# Altium project controller_8266.PrjPcb
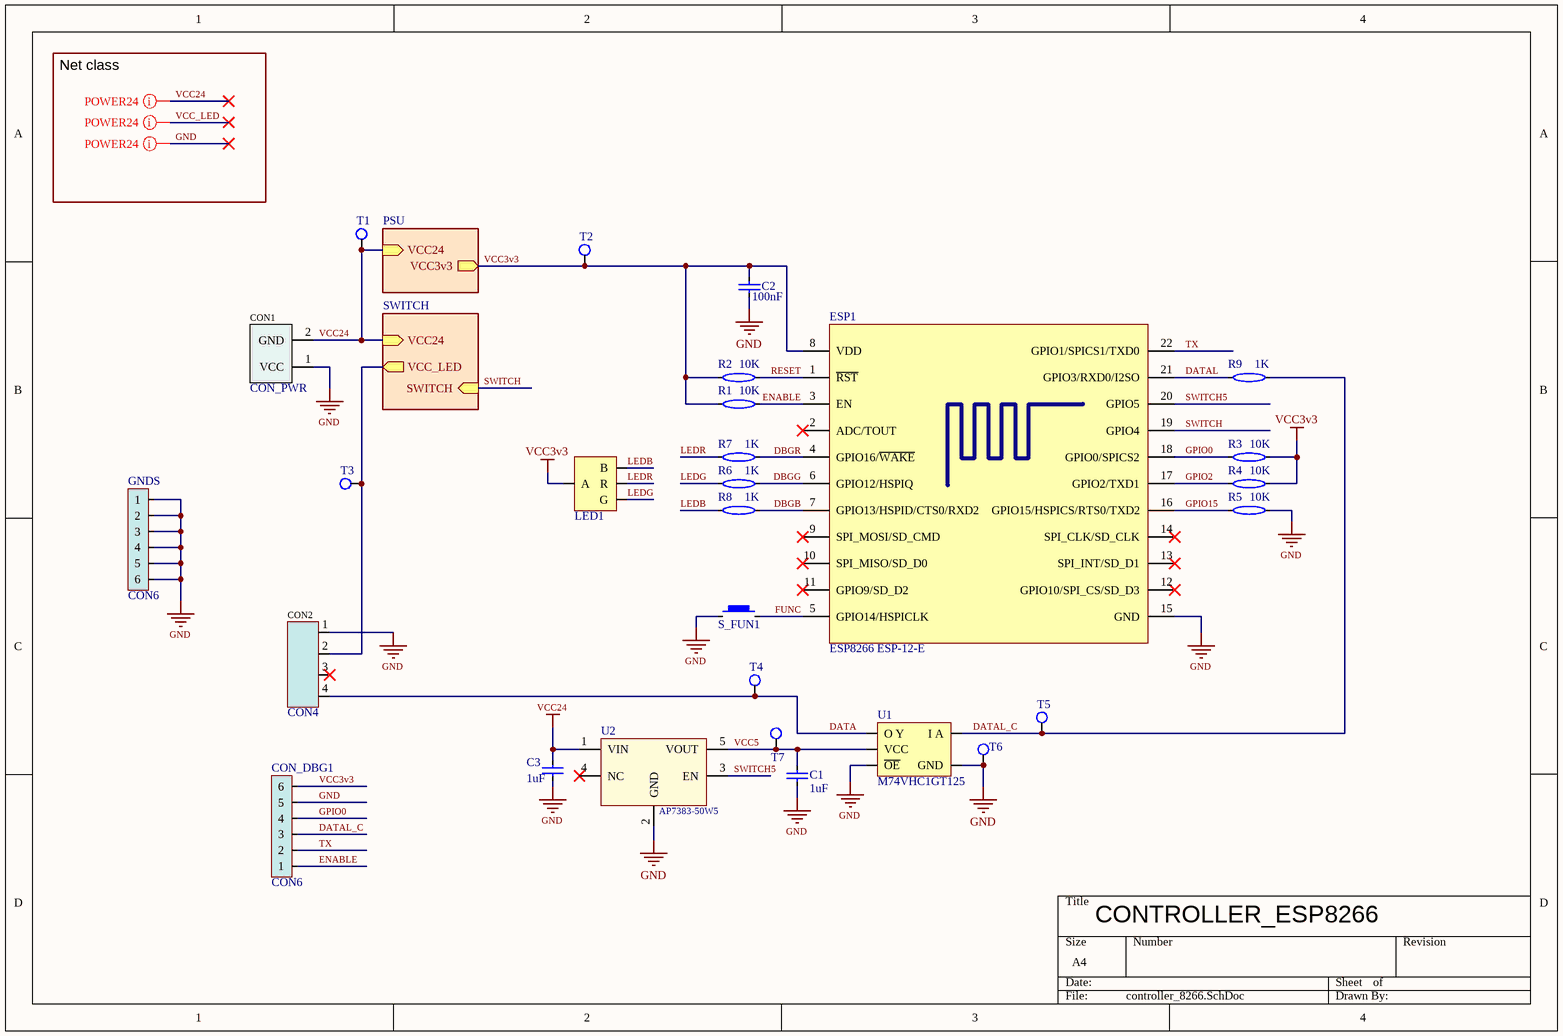
[diagram p0: controller_8266.SchDoc]
3 sheets, 44 parts. Net scope: hierarchical (ports join the sheet entries above them; power ports are global).
Board file: controller_8266.PcbDoc
Sheets:
  controller_8266.SchDoc
    PSU = controller_8266_psu.SchDoc
    SWITCH = controller_8266_switch.SchDoc

## Sheet controller_8266.SchDoc: CONTROLLER_ESP8266
size A4; DocumentNumber: 1; SheetNumber: 1; SheetTotal: 3

### Parts
C1  value 1uF  [CAPC_0603_1608X08L]  (hidden comment: Cap)
C2  value 100nF  [CAPC_0603_1608X08L]  (hidden comment: Cap)
C3  value 1uF  [CAPC_0603_1608X08L]  (hidden comment: Cap)
CON1  CON_PWR  [CONPWR]  (no BOM)
CON2  CON4  [CONNECTOR]  (no BOM)
CON_DBG1  CON6  [CON2X3]  (no BOM)
ESP1  ESP8266 ESP-12-E  [ESP8266 ESP-12-E]
GNDS  CON6  [CON2X3]  (no BOM)
LED1  RGB LED Common anode  [PLCC-4]  (value not drawn)
R1  value 10K  [RESC_0603_1608X08L]  (hidden comment: Res2)
R2  value 10K  [RESC_0603_1608X08L]  (hidden comment: Res2)
R3  value 10K  [RESC_0603_1608X08L]  (hidden comment: Res2)
R4  value 10K  [RESC_0603_1608X08L]  (hidden comment: Res2)
R5  value 10K  [RESC_0603_1608X08L]  (hidden comment: Res2)
R6  value 1K  [RESC_0603_1608X08L]  (hidden comment: Res2)
R7  value 1K  [RESC_0603_1608X08L]  (hidden comment: Res2)
R8  value 1K  [RESC_0603_1608X08L]  (hidden comment: Res2)
R9  value 1K  [RESC_0603_1608X08L]  (hidden comment: Res2)
S_FUN1  4-1437565-1  [EVQP7C01P]  (value not drawn)
T1  Testpoint  [TESTPOINT]  (value not drawn)  (no BOM)
T2  Testpoint  [TESTPOINT]  (value not drawn)  (no BOM)
T3  Testpoint  [TESTPOINT]  (value not drawn)  (no BOM)
T4  Testpoint  [TESTPOINT]  (value not drawn)  (no BOM)
T5  Testpoint  [TESTPOINT]  (value not drawn)  (no BOM)
T6  Testpoint  [TESTPOINT]  (value not drawn)  (no BOM)
T7  Testpoint  [TESTPOINT]  (value not drawn)  (no BOM)
U1  M74VHC1GT125  [SOT95P285X130-5N]
U2  AP7383-50W5  [SOT95P285X130-5N]

### Sub-sheets
PSU = controller_8266_psu.SchDoc: VCC3v3 (out), VCC24 (in)
SWITCH = controller_8266_switch.SchDoc: VCC24 (in), VCC_LED (out), SWITCH (in)

### Nets
GND: C1.1 C2.2 C3.1 CON1.1(VCC) CON2.1 CON_DBG1.5 ESP1.15(GND) GNDS.1 GNDS.2 GNDS.3 GNDS.4 GNDS.5 GNDS.6 R5.2 S_FUN1.2 T6.1(VOUT) U1.1(~{OE}) U1.3(GND) U2.2(GND)
VCC3v3: C2.1 CON_DBG1.6 ESP1.8(VDD) LED1.A R1.1 R2.2 R3.2 R4.2 T2.1(VOUT) ; sheet PSU/VCC3v3
VCC24: C3.2 CON1.2(GND) T1.1(VOUT) U2.1(VIN) ; sheet PSU/VCC24, sheet SWITCH/VCC24
DATA: CON2.4 T4.1(VOUT) U1.4(O_Y)
DATAL: ESP1.21(GPIO3/RXD0/I2SO) R9.2
DATAL_C: CON_DBG1.3 R9.1 T5.1(VOUT) U1.2(I_A)
DBGB: ESP1.7(GPIO13/HSPID/CTS0/RXD2) R8.2
DBGG: ESP1.6(GPIO12/HSPIQ) R6.2
DBGR: ESP1.4(GPIO16/~{WAKE}) R7.2
ENABLE: CON_DBG1.1 ESP1.3(EN) R1.2
FUNC: ESP1.5(GPIO14/HSPICLK) S_FUN1.1
GPIO0: CON_DBG1.4 ESP1.18(GPIO0/SPICS2) R3.1
GPIO2: ESP1.17(GPIO2/TXD1) R4.1
GPIO15: ESP1.16(GPIO15/HSPICS/RTS0/TXD2) R5.1
LEDB: LED1.B R8.1
LEDG: LED1.G R6.1
LEDR: LED1.R R7.1
RESET: ESP1.1(~{RST}) R2.1
SWITCH: ESP1.19(GPIO4) ; sheet SWITCH/SWITCH
SWITCH5: ESP1.20(GPIO5) U2.3(EN)
TX: CON_DBG1.2 ESP1.22(GPIO1/SPICS1/TXD0)
VCC5: C1.2 T7.1(VOUT) U1.5(VCC) U2.5(VOUT)
NetCON2_2: CON2.2 T3.1(VOUT) ; sheet SWITCH/VCC_LED

Not connected (* = marked no-connect by the designer): CON2 3*; ESP1 2(ADC/TOUT)* 9(SPI_MOSI/SD_CMD)* 10(SPI_MISO/SD_D0)* 11(GPIO9/SD_D2)* 12(GPIO10/SPI_CS/SD_D3)* 13(SPI_INT/SD_D1)* 14(SPI_CLK/SD_CLK)*; U2 4(NC)*

### Layout directives
net class POWER24: GND, VCC24, VCC_LED

### Notes on the sheet
- Net class

### Library data of the parts
C1-C3 = Cap: Capacitor; Published: 8-Jun-2000; LatestRevisionDate: 17-Jul-2002; LatestRevisionNote: Re-released for DXP Platform.; PackageReference: RAD-0.3; Publisher: Altium Limited; PackageDescription: Radial Cap, Thru-Hole; 2 Leads; 0.3 in Pin Spacing
CON1 = CON_PWR: Header 2 way
CON2 = CON4: Header 4 way
CON_DBG1 GNDS = CON6: Debug header 6 way
LED1 = RGB_LED: Dot is _not_ anode!
R1-R9 = Res2: Resistor; Published: 8-Jun-2000; LatestRevisionDate: 17-Jul-2002; LatestRevisionNote: Re-released for DXP Platform.; PackageReference: AXIAL-0.4; Publisher: Altium Limited; PackageDescription: Axial Device, Thru-Hole; 2 Leads; 0.4 in Pin Spacing
S_FUN1 = 4-1437565-1: Tactile switch; Manufacturer_Name: TE Connectivity; Allied_Number: R1117787; RS Part Number: 1616046; Manufacturer_Part_Number: 4-1437565-1; Datasheet Link: http://uk.rs-online.com/web/p/products/1616046
U1 = M74VHC1GT125: Level shifter non inverting

## Sheet controller_8266_psu.SchDoc: CONTROLLER_ESP8266_PSU
size A4; DocumentNumber: 2; SheetNumber: 2; SheetTotal: 3
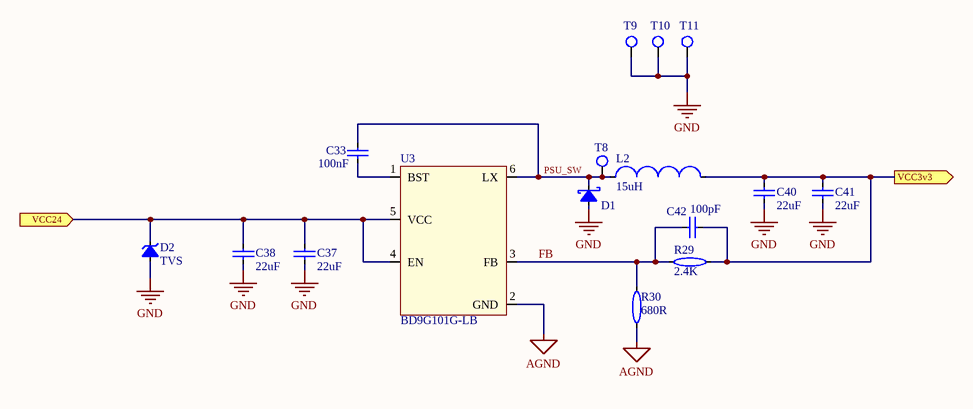
[diagram p1: controller_8266_psu.SchDoc]

### Parts
C33  value 100nF  [CAPC_0603_1608X08L]  (hidden comment: Cap)
C37  value 22uF  [CAPC_1206_3216X16L]  (hidden comment: Cap)
C38  value 22uF  [CAPC_1206_3216X16L]  (hidden comment: Cap)
C40  value 22uF  [CAPC_1206_3216X16L]  (hidden comment: Cap)
C41  value 22uF  [CAPC_1206_3216X16L]  (hidden comment: Cap)
C42  value 100pF  [CAPC_0603_1608X08L]  (hidden comment: Cap)
D1  Schottky 40V 3A  [SOD123]  (value not drawn)
D2  TVS  [SODFL350X120-2L]
L2  value 15uH  [INDP4949X30N]  (hidden comment: Inductor)
R29  value 2.4K  [RESC_0603_1608X08L]  (hidden comment: Res2)
R30  value 680R  [RESC_0603_1608X08L]  (hidden comment: Res2)
T8  Testpoint  [TESTPOINT]  (value not drawn)  (no BOM)
T9  Testpoint  [TESTPOINT]  (value not drawn)  (no BOM)
T10  Testpoint  [TESTPOINT]  (value not drawn)  (no BOM)
T11  Testpoint  [TESTPOINT]  (value not drawn)  (no BOM)
U3  BD9G101G-LB  [TSOP95P280X125-6L]

### Ports
VCC3v3 (out), VCC24 (in)

### Nets
AGND: R30.2 U3.2(GND)
GND: C37.1 C38.1 C40.1 C41.1 D1.1(A) D2.1(A) T9.1(VOUT) T10.1(VOUT) T11.1(VOUT)
VCC3v3: C40.2 C41.2 C42.2 L2.2 R29.1 ; port VCC3v3
VCC24: C37.2 C38.2 D2.2(K) U3.4(EN) U3.5(VCC) ; port VCC24
FB: C42.1 R29.2 R30.1 U3.3(FB)
PSU_SW: C33.2 D1.2(K) L2.1 T8.1(VOUT) U3.6(LX)
NetC33_1: C33.1 U3.1(BST)

### Library data of the parts
C33 C37 C38 C40-C42 = Cap: Capacitor; Published: 8-Jun-2000; LatestRevisionDate: 17-Jul-2002; LatestRevisionNote: Re-released for DXP Platform.; PackageReference: RAD-0.3; Publisher: Altium Limited; PackageDescription: Radial Cap, Thru-Hole; 2 Leads; 0.3 in Pin Spacing
D1 = D Schottky: Schottky Diode; Published: 8-Jun-2000; LatestRevisionDate: 17-Jul-2002; LatestRevisionNote: Re-released for DXP Platform.; PackageReference: SMB; Publisher: Altium Limited; PackageDescription: DO-214-AA/SMB; 2 C-Bend Leads; Body 5.3 x 3.6 mm, inc. leads (LxW); Code_JEDEC: DO-214-AA
D2 = D Zener: Schottky Diode; Manufacturer Part Number: SMBJ24CA; Manufacturer: Littelfuse; Published: 8-Jun-2000; LatestRevisionDate: 17-Jul-2002; LatestRevisionNote: Re-released for DXP Platform.; PackageReference: SMB; Publisher: Altium Limited; PackageDescription: DO-214-AA/SMB; 2 C-Bend Leads; Body 5.3 x 3.6 mm, inc. leads (LxW); Code_JEDEC: DO-214-AA; Vz: *
L2 = Inductor: Code_IEC: 1005; Published: 8-Jun-2000; LatestRevisionDate: 29-May-2009; LatestRevisionNote: IPC-7351 Footprint Added.; PackageReference: 0402-A; Publisher: Altium Limited; PackageDescription: Chip Inductor; Code_JEITA: 0402
R29 R30 = Res2: Resistor; Published: 8-Jun-2000; LatestRevisionDate: 17-Jul-2002; LatestRevisionNote: Re-released for DXP Platform.; PackageReference: AXIAL-0.4; Publisher: Altium Limited; PackageDescription: Axial Device, Thru-Hole; 2 Leads; 0.4 in Pin Spacing
U3 = BD9G102G-LB

## Sheet controller_8266_switch.SchDoc
size A4; DocumentNumber: 3; SheetNumber: 3; SheetTotal: 3
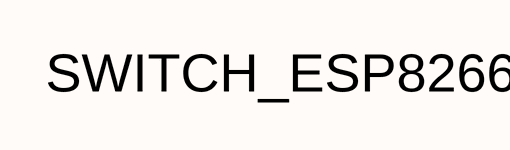
[diagram p2: controller_8266_switch.SchDoc]

### Notes on the sheet
- SWITCH_ESP8266

## Nets that join several sheets
GND: controller_8266 (19 pins), controller_8266_psu (9 pins)
VCC3v3: controller_8266 (9 pins), controller_8266_psu (5 pins)
VCC24: controller_8266 (C3.2 CON1.2 T1.1 U2.1), controller_8266_psu (5 pins)